# Altium schematic sheet Conexion_PCB2.SchDoc: Conexión a Placa de Medición
size A4; Author: **; CompanyName: Introducción al Diseño de Circuitos Impresos; Organization: UTN FRBA; DocumentNumber: 9; Revision: 01; SheetNumber: 9; SheetTotal: 9; Autor: Eugenia Ipar
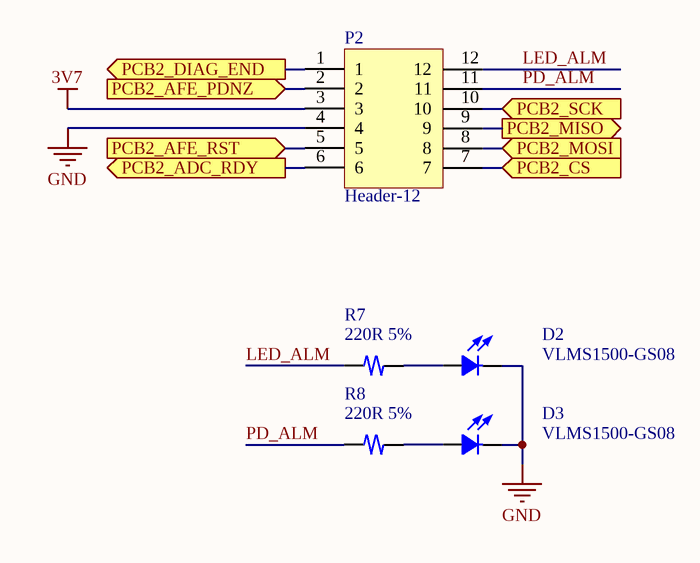
[diagram p0: Conexion_PCB2.SchDoc]

## Parts
D2  VLMS1500-GS08  [L_0402]
D3  VLMS1500-GS08  [L_0402]
P2  Header-12  [HEADER 12]
R7  220R 5%  [R_0402]
R8  220R 5%  [R_0402]

## Ports
PCB2_ADC_RDY (out), PCB2_AFE_PDNZ (in), PCB2_AFE_RST (in), PCB2_CS (in), PCB2_DIAG_END (out), PCB2_MISO (out), PCB2_MOSI (in), PCB2_SCK (in)

## Nets
3V7: P2.3
GND: D2.2 D3.2 P2.4
LED_ALM: P2.12 R7.1
PCB2_ADC_RDY: P2.6 ; port PCB2_ADC_RDY
PCB2_AFE_PDNZ: P2.2 ; port PCB2_AFE_PDNZ
PCB2_AFE_RST: P2.5 ; port PCB2_AFE_RST
PCB2_CS: P2.7 ; port PCB2_CS
PCB2_DIAG_END: P2.1 ; port PCB2_DIAG_END
PCB2_MISO: P2.9 ; port PCB2_MISO
PCB2_MOSI: P2.8 ; port PCB2_MOSI
PCB2_SCK: P2.10 ; port PCB2_SCK
PD_ALM: P2.11 R8.1
NetD2_1: D2.1 R7.2
NetD3_1: D3.1 R8.2

## Notes on the sheet
- Title:
- Size:
- Author:
- A4
- Sheet
- of
- Revision:
- File:
- Date:

## Library data of the parts
D2 D3 = Diode LED: LED Diode SMD 0402
P2 = 12-Pin Header: Board to Board & Mezzanine Connector 0.8 BtB Molex PN: 53307-1271
R7 R8 = Resistor: Resistor SMD 0402